# EAGLE design Motor Board (EAGLE 9.5.1)
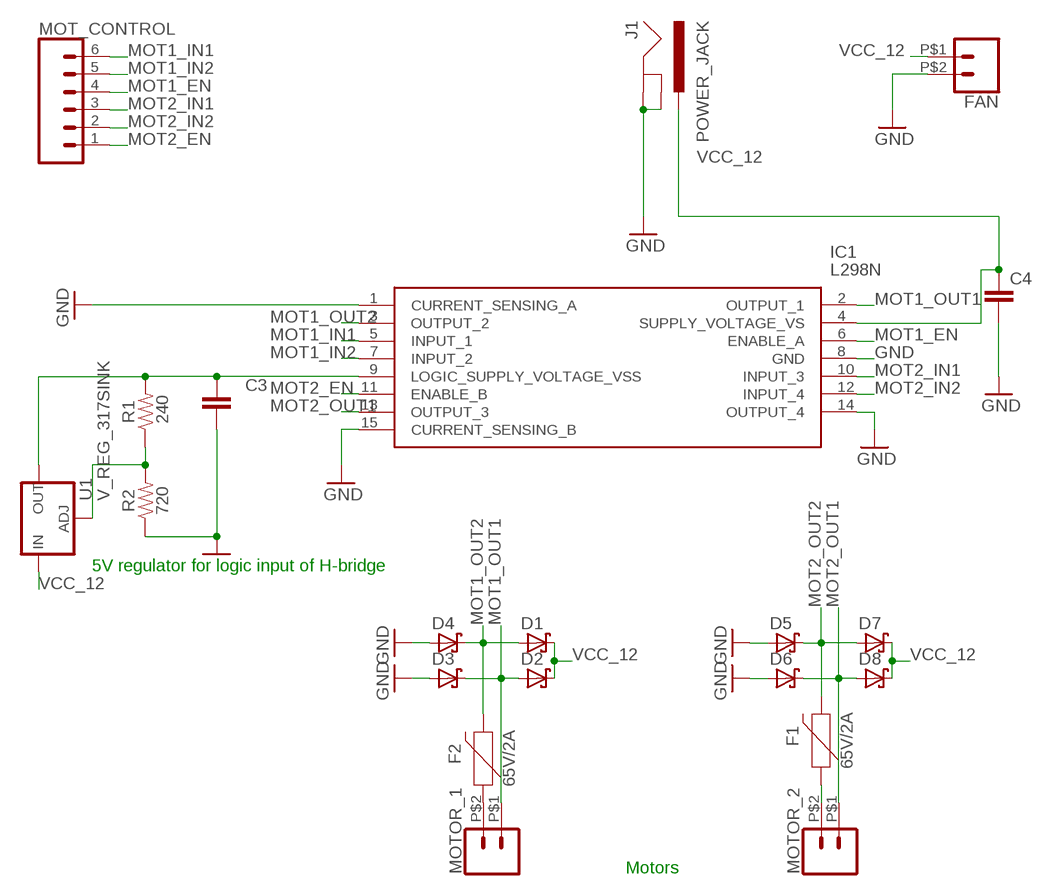
[diagram p0: schematic, sheet 1]

## Parts
C3  C5/5  [C5B5]
C4  C5/5  [C5B5]
D1  SCHOTTKY-DIODEC4111-15  [C4111-15]
D2  SCHOTTKY-DIODEC4111-15  [C4111-15]
D3  SCHOTTKY-DIODEC4111-15  [C4111-15]
D4  SCHOTTKY-DIODEC4111-15  [C4111-15]
D5  SCHOTTKY-DIODEC4111-15  [C4111-15]
D6  SCHOTTKY-DIODEC4111-15  [C4111-15]
D7  SCHOTTKY-DIODEC4111-15  [C4111-15]
D8  SCHOTTKY-DIODEC4111-15  [C4111-15]
F1  65V/2A  PPTC_PTH  [PTH]
F2  65V/2A  PPTC_PTH  [PTH]
FAN  CONN_02PTH2  [1X02_BIG]
IC1  L298N  [MULTIWATT15V_1]
J1  POWER_JACK  [POWER_JACK_PTH]
MOT_CONTROL  CONN_06SILK_FEMALE_PTH  [1X06]
MOTOR_1  CONN_02PTH2  [1X02_BIG]
MOTOR_2  CONN_02PTH2  [1X02_BIG]
R1  240  RESISTORAXIAL-0.3  [AXIAL-0.3]
R2  720  RESISTORAXIAL-0.3  [AXIAL-0.3]
U1  V_REG_317SINK  [TO220-ADJ]

## Nets
GND: C3.2 C4.2 D3.A D4.A D5.A D6.A FAN.P$2 IC1.1(CURRENT_SENSING_A) IC1.8(GND) IC1.14(OUTPUT_4) IC1.15(CURRENT_SENSING_B) J1.GND J1.GNDBREAK R2.P$1
MOT1_EN: IC1.6(ENABLE_A) MOT_CONTROL.4
MOT1_IN1: IC1.5(INPUT_1) MOT_CONTROL.6
MOT1_IN2: IC1.7(INPUT_2) MOT_CONTROL.5
MOT1_OUT1: D2.A D3.C IC1.2(OUTPUT_1) MOTOR_1.P$1
MOT1_OUT2: D1.A D4.C F2.P$2 IC1.3(OUTPUT_2)
MOT2_EN: IC1.11(ENABLE_B) MOT_CONTROL.1
MOT2_IN1: IC1.10(INPUT_3) MOT_CONTROL.3
MOT2_IN2: IC1.12(INPUT_4) MOT_CONTROL.2
MOT2_OUT1: D6.C D8.A IC1.13(OUTPUT_3) MOTOR_2.P$1
MOT2_OUT2: D5.C D7.A F1.P$2
N$1: F2.P$1 MOTOR_1.P$2
N$2: F1.P$1 MOTOR_2.P$2
N$3: C3.1 IC1.9(LOGIC_SUPPLY_VOLTAGE_VSS) R1.P$2 U1.OUT
N$4: R1.P$1 R2.P$2 U1.ADJ
VCC_12: C4.1 D1.C D2.C D7.C D8.C FAN.P$1 IC1.4(SUPPLY_VOLTAGE_VS) J1.PWR U1.IN

## Notes on the sheet
- 5V regulator for logic input of H-bridge
- Motors

## Library data of the parts
C3 C4 = capacitor-wima:C: CAPACITOR naming: grid - package width
D1-D8 = adafruit:SCHOTTKY-DIODE: Schottky Diode
F1 F2 = SparkFun-Fuses:PPTC: Resettable Fuse PPTC Resettable Fuse. Really a sort of resistor with a polymeric positive temperature coefficient whose resistance increases dramatically with an increase in temperature. When heated by the power passing through the resistance rises causing the current to be limited, protecting the circuit. This is achieved by the transition of the polymer from a crystalline to an amorphous state where the conductive carbon separates breaking the conductive pathways found in the cool crystalline structure. When a PPTC cools back down it resumes conducting letting the circuit turn back on. SparkFun Products: SparkFun RedBoard - Programmed with Arduino <https://www.sparkfun.com/products/12757> Pro Micro - 5V/16MHz <https://www.sparkfun.com/products/12640> Arduino Pro 328 - 5V/16MHz <https://www.sparkfun.com/products/10915> MP3 Trigger <https://www.sparkfun.com/products/13720>; PROD_ID: RES-08490; VALUE: 72V/0.25A
FAN MOTOR_1 MOTOR_2 = SparkFun-Connectors:CONN_02: Multi connection point. Often used as Generic Header-pin footprint for 0.1 inch spaced/style header connections On any of the 0.1 inch spaced packages, you can populate with these: Break Away Headers - Straight <https://www.sparkfun.com/products/116> (PRT-00116) Break Away Male Headers - Right Angle <https://www.sparkfun.com/products/553> (PRT-00553) Female Headers <https://www.sparkfun.com/products/115> (PRT-00115) Break Away Headers - Machine Pin <https://www.sparkfun.com/products/117> (PRT-00117) Break Away Female Headers - Swiss Machine Pin <https://www.sparkfun.com/products/743> (PRT-00743) For SCREWTERMINALS and SPRING TERMINALS visit here: Screw Terimnals on SparkFun.com <https://www.sparkfun.com/search/results?term=Screw+Terminals> (5mm/3.5mm/2.54mm spacing) This device is also useful as a general connection point to wire up your design to another part of your project. Our various solder wires solder well into these plated through hole pads. Hook-Up Wire - Assortment (Stranded, 22 AWG) <https://www.sparkfun.com/products/11375> (PRT-11375) Hook-Up Wire - Assortment (Solid Core, 22 AWG) <https://www.sparkfun.com/products/11367> (PRT-11367) View the entire wire category on our website here <https://www.sparkfun.com/categories/141> Special notes: Molex polarized connector foot print use with: PRT-08233 with associated crimp pins and housings. 2.54_SCREWTERM for use with PRT-10571. 3.5mm Screw Terminal footprints for PRT-08084 5mm Screw Terminal footprints for use with PRT-08432
IC1 = SamacSys_Parts:L298N: L298N, Stepper Motor Controller, Dual Full Bridge Motor Driver, 4.8 46 V, 15-Pin MULTIWATT V Source: Datasheet <http://docs-emea.rs-online.com/webdocs/0060/0900766b80060c26.pdf>; DESCRIPTION: L298N, Stepper Motor Controller, Dual Full Bridge Motor Driver, 4.8 46 V, 15-Pin MULTIWATT V; HEIGHT: mm; MANUFACTURER_NAME: Magnatec; MANUFACTURER_PART_NUMBER: L298N; RS_PART_NUMBER: 0636384; RS_PRICE-STOCK: http://uk.rs-online.com/web/p/products/0636384
J1 = SparkFun-Connectors:POWER_JACK: Power Jack Connector This is the standard 5.5mm barrel jack for power. The PTH is the most common, proven, reliable, footprint. The Slot footprint only works if the mill layer is transmitted to the PCB fab house so be warned. Here are the connectors we sell at SparkFun: DC Barrel Power Jack/Connector <https://www.sparkfun.com/products/119> (PRT-00119) DC Barrel Power Jack/Connector (SMD) <https://www.sparkfun.com/products/12748> (PRT-12748) DC Barrel Jack Adapter - Breadboard Compatible <https://www.sparkfun.com/products/10811> (PRT-10811) It is used on this SparkFun product (and many, many others): SparkFun RedBoard - Programmed with Arduino <https://www.sparkfun.com/products/12757> (DEV-12757) Also, if you need a mating power supply or connector, please check these out: Wall Adapter Power Supply - 9VDC 650mA <https://www.sparkfun.com/products/298> (TOL-00298) DC Barrel Jack Adapter - Male <https://www.sparkfun.com/products/10287> (PRT-10287); PROD_ID: CONN-08197
MOT_CONTROL = SparkFun-Connectors:CONN_06: Multi connection point. Often used as Generic Header-pin footprint for 0.1 inch spaced/style header connections On any of the 0.1 inch spaced packages, you can populate with these: Break Away Headers - Straight <https://www.sparkfun.com/products/116> (PRT-00116) Break Away Male Headers - Right Angle <https://www.sparkfun.com/products/553> (PRT-00553) Female Headers <https://www.sparkfun.com/products/115> (PRT-00115) Break Away Headers - Machine Pin <https://www.sparkfun.com/products/117> (PRT-00117) Break Away Female Headers - Swiss Machine Pin <https://www.sparkfun.com/products/743> (PRT-00743) Arduino Stackable Header - 6 Pin <https://www.sparkfun.com/products/9280> (PRT-09280) For SCREWTERMINALS and SPRING TERMINALS visit here: Screw Terimnals on SparkFun.com <https://www.sparkfun.com/search/results?term=Screw+Terminals> (5mm/3.5mm/2.54mm spacing) This device is also useful as a general connection point to wire up your design to another part of your project. Our various solder wires solder well into these plated through hole pads. Hook-Up Wire - Assortment (Stranded, 22 AWG) <https://www.sparkfun.com/products/11375> (PRT-11375) Hook-Up Wire - Assortment (Solid Core, 22 AWG) <https://www.sparkfun.com/products/11367> (PRT-11367) View the entire wire category on our website here <https://www.sparkfun.com/categories/141>; PROD_ID: CONN-08437
R1 R2 = SparkFun-Resistors:RESISTOR: Generic Resistor Package
U1 = SparkFun-IC-Power:V_REG_317: Voltage Regulator Standard LM317 adjustable voltage regulator. AOI (Adjust Output Input). Google 'LM317 Calculator' for easy to use app to get the two resistor values needed. 240/720 for 5V output. 240/390 for 3.3V output. Spark Fun Electronics SKU : COM-00527

## Board
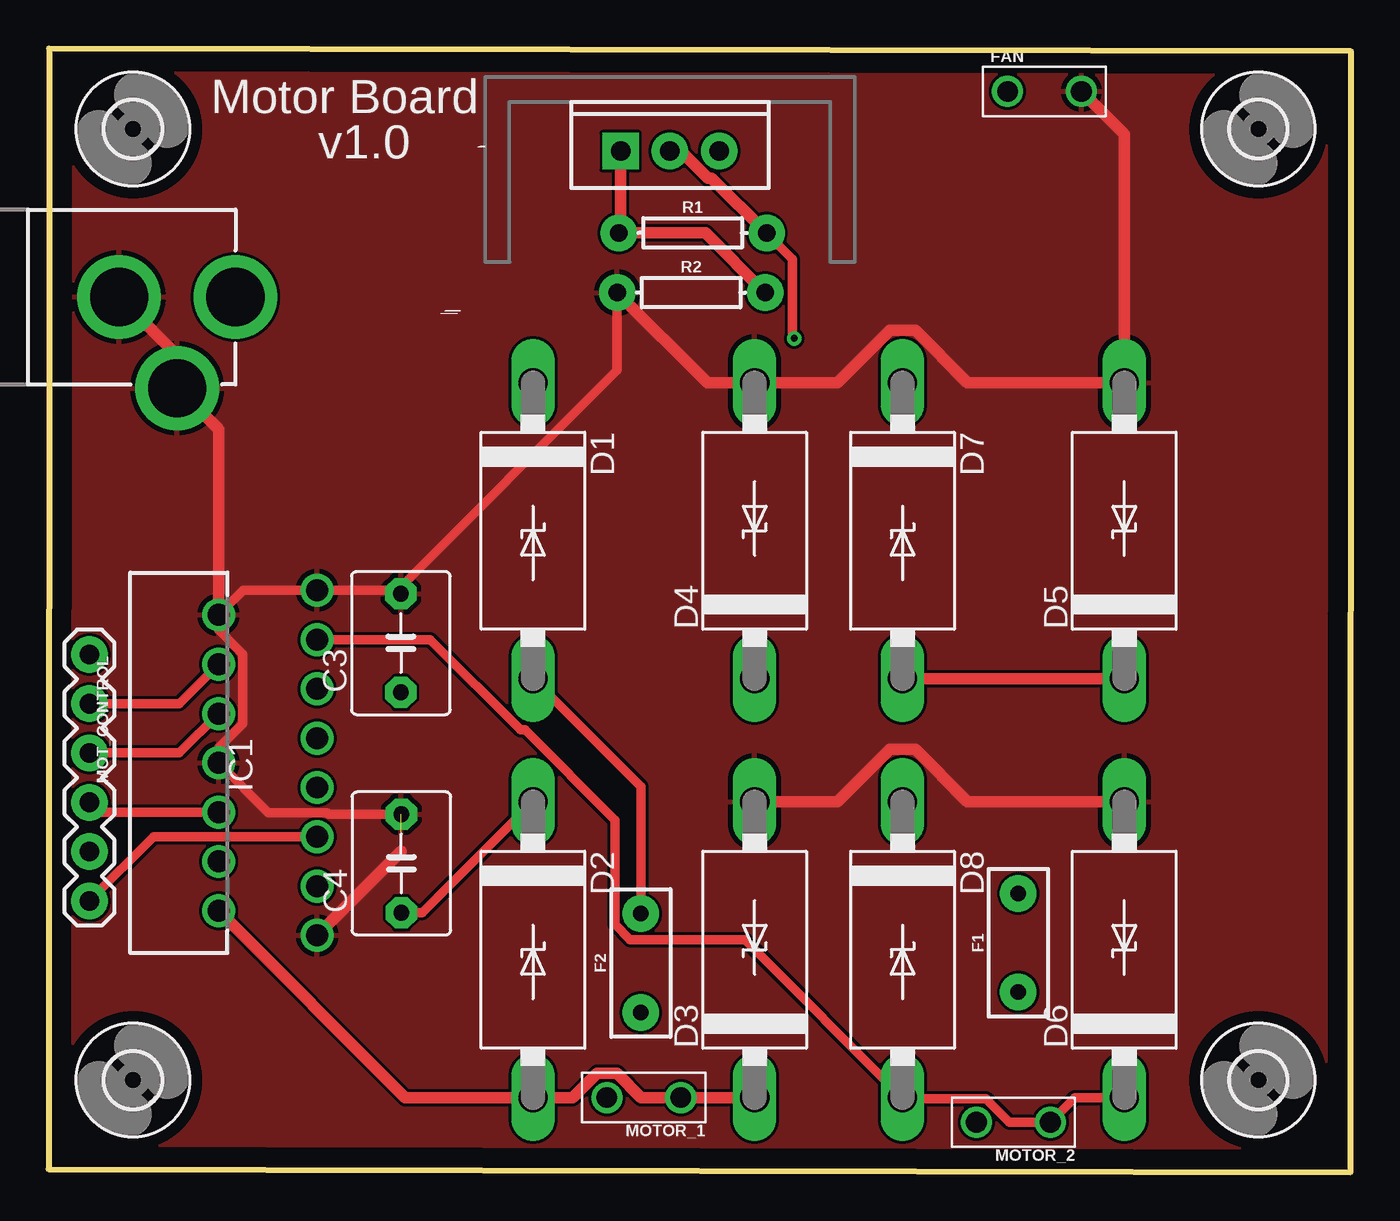
[diagram p1: board, top side]
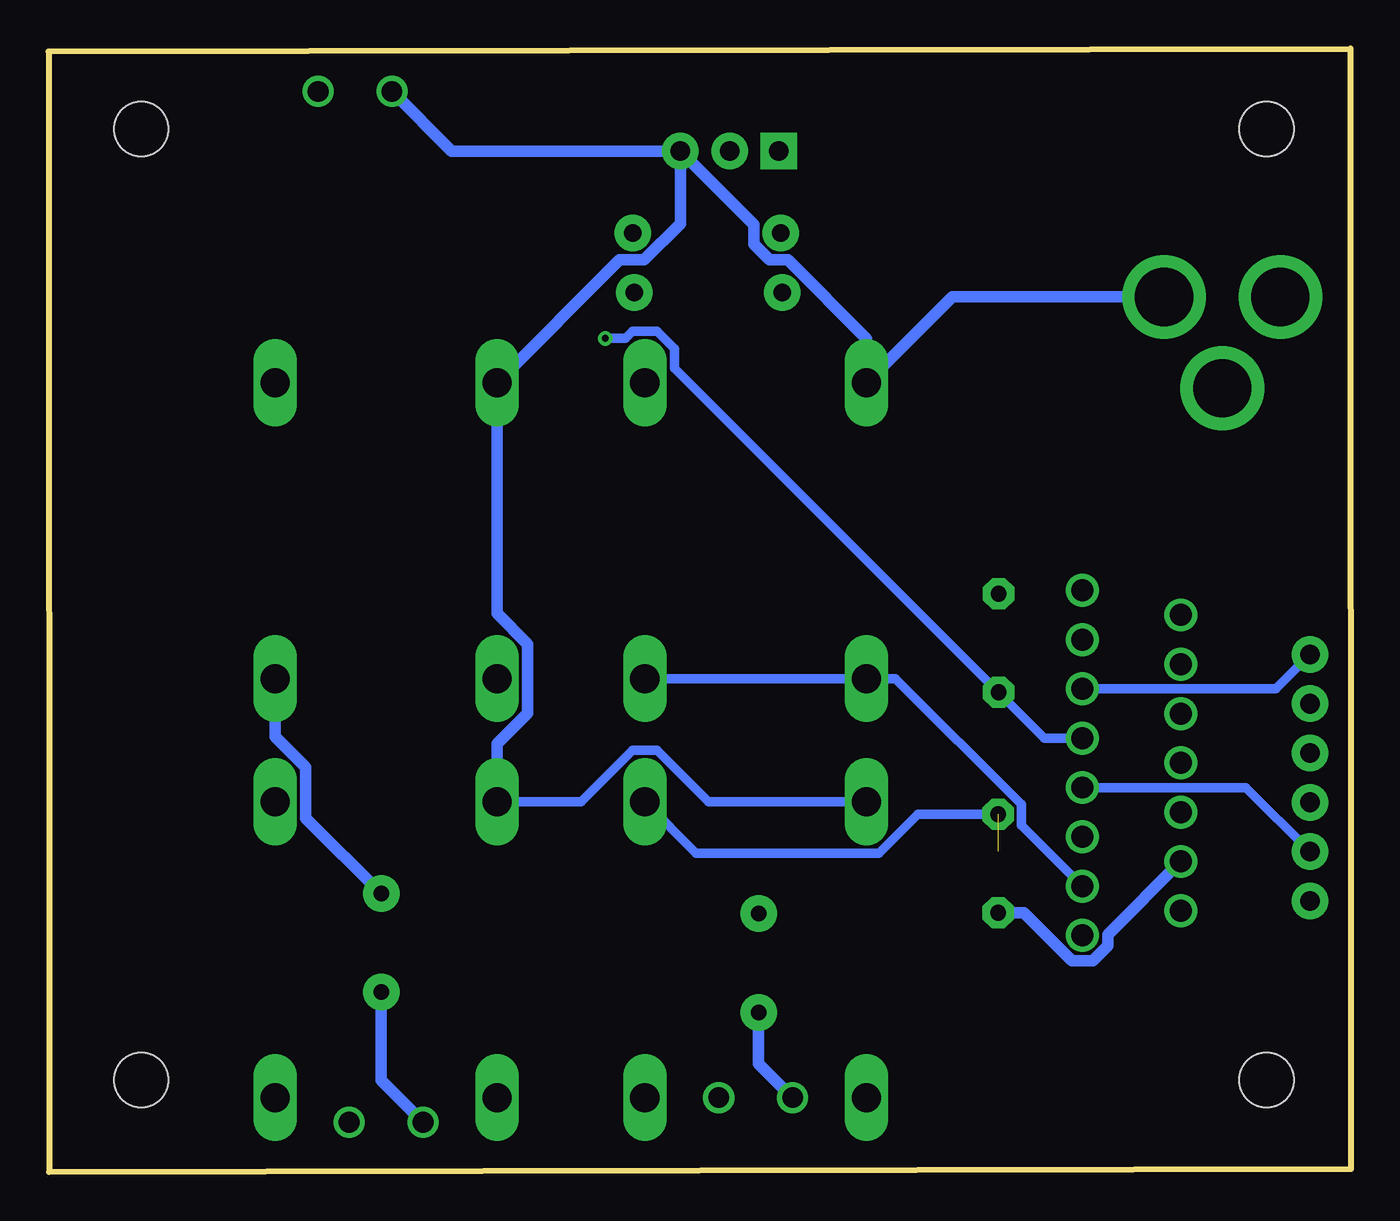
[diagram p2: board, bottom side, seen from below]

Size 67.13 x 57.89 mm. Coordinates in mm from the lower left corner, seen from the top.
Outline: 0,0.15 67.11,0 67.13,57.73 0.03,57.89 0,0.15
Copper layers (1*16): Top 0.035mm / dielectric 1.5mm / Bottom 0.035mm
Design rules "default": minimum track width 6mil, minimum drill 0.35mm, track to track 6mil, track to pad 6mil, pad to pad 6mil, via to via 6mil, smd to smd 6mil, copper to edge 40mil, drill to drill 6mil, minimum pad ring 10mil, minimum via ring 8mil, stop-mask expansion 4mil, vias tented up to drill 0mil, thermal gap 10mil

### Footprints (pad centres in the part's own frame; a part is rotated, then mirrored left to right if it is on the bottom)
C5B5 = drill 0.813 pad 1.6 octagon: 1 -2.54,0; 2 2.54,0
C4111-15 = drill 1.499 long: A 7.62,0; C -7.62,0
PTH = drill 0.8 pad 1.88: P$1 -2.54,0; P$2 2.54,0
1X02_BIG = drill 1.067: P$1 0,0; P$2 3.81,0
MULTIWATT15V_1 = drill 1.13 pad 1.63: 1 -8.89,-5.08; 2 -7.62,0; 3 -6.35,-5.08; 4 -5.08,0; 5 -3.81,-5.08; 6 -2.54,0; 7 -1.27,-5.08; 8 0,0; 9 1.27,-5.08; 10 2.54,0; 11 3.81,-5.08; 12 5.08,0; 13 6.35,-5.08; 14 7.62,0; 15 8.89,-5.08
POWER_JACK_PTH = drill 2.997 pad 4.318: GND 0,7.7; GNDBREAK 4.7,10.7; PWR 0,13.7
1X06 = drill 1.016 pad 1.88: 1 0,0; 2 2.54,0; 3 5.08,0; 4 7.62,0; 5 10.16,0; 6 12.7,0
AXIAL-0.3 = drill 0.9 pad 1.88: P$1 -3.81,0; P$2 3.81,0
TO220-ADJ = drill 1 pad 1.88 square: ADJ -2.54,0 | drill 1 pad 1.88: IN 2.54,0; OUT 0,0
2,8 = hole 2.8: 0,0

### Placement (x,y rotation side)
C3  18.16,27.25 90 top
C4  18.19,15.9 90 top
D1  24.97,33.05 270 top
D2  24.97,11.46 270 top
D3  36.4,11.46 90 top
D4  36.4,33.05 90 top
D5  55.45,33.05 90 top
D6  55.45,11.46 90 top
D7  44.02,33.05 270 top
D8  44.02,11.46 270 top
F1  49.99,11.81 90 top
F2  30.53,10.77 90 top
FAN  49.43,55.68 0 top
IC1  8.76,21.08 90 top
J1  -4.06,45.09 270 top
MOT_CONTROL  2.11,26.67 270 top
MOTOR_1  32.59,3.84 180 top
MOTOR_2  51.64,2.57 180 top
R1  33.2,48.39 0 top
R2  33.12,45.31 0 top
U1  32.03,52.6 0 top
U$2  [2,8]  4.36,53.74 0 top
U$3  [2,8]  62.36,4.74 0 top
U$4  [2,8]  4.36,4.74 180 top
U$5  [2,8]  62.36,53.74 0 top

### Tracks (layer width: path | path; a pad name or v marks a point on that pad's centre or on a via)
GND  (1 unrouted)
  Top 0.5: C4.2 14.44,18.44 14.36,18.52 11.32,18.52 IC1.8 8.76,21.85 10.01,23.1 10.01,26.68 8.76,27.93 IC1.14 10.03,29.97 IC1.15 17.98,29.97 | 17.98,29.97 C3.2 | R2.P$1 29.31,41.3 17.98,29.97
  Top 0.6: FAN.P$2 55.45,53.47 D5.A 47.37,40.67 44.67,43.37 43.37,43.37 40.66,40.67 D4.A 33.96,40.67 R2.P$1 | J1.GND 6.64,42.09 J1.GNDBREAK 8.76,38.26 IC1.14 | IC1.1 18.19,16.54 | D3.A 40.66,19.08 43.37,21.78 44.67,21.78 47.37,19.08 D6.A
  Bottom 0.5: C4.2 22.32,18.44 24.34,16.43 33.75,16.43 D3.A
  pour Top: 0,0.23 67.16,0.23 67.16,57.76 -0.03,57.76 -0.03,0.41 0,0.38
MOT1_EN
  Top 0.5: IC1.6 2.62,18.54 MOT_CONTROL.4
MOT1_IN1
  Top 0.5: IC1.5 5.41,17.27 MOT_CONTROL.6
MOT1_IN2
  Bottom 0.5: MOT_CONTROL.5 5.41,19.81 IC1.7
MOT1_OUT1
  Top 0.6: D3.C MOTOR_1.P$1 30.55,3.84 29.3,5.09 28.26,5.09 27.01,3.84 D2.A 18.39,3.84 IC1.2
MOT1_OUT2
  Top 0.5: D1.A 30.53,19.86 F2.P$2
  Bottom 0.5: IC1.3 16.98,17.87 16.98,18.94 23.47,25.43 D1.A D4.C
MOT2_EN
  Bottom 0.5: MOT_CONTROL.1 3.89,24.89 IC1.11
MOT2_IN1
  Top 0.5: IC1.10 6.73,21.59 MOT_CONTROL.3
MOT2_IN2
  Top 0.5: IC1.12 6.73,24.13 MOT_CONTROL.2
MOT2_OUT1
  Top 0.5: D6.C 52.91,3.84 MOTOR_2.P$1 49.53,2.57 48.33,3.77 44.09,3.77 D8.A 35.89,11.97 29.98,11.97 29.19,12.75 29.19,18.14 24.55,22.78 24.34,22.78 19.68,27.43 IC1.13
MOT2_OUT2
  Top 0.6: D7.A D5.C
  Bottom 0.6: F1.P$2 53.87,18.24 53.87,20.85 55.45,22.43 D5.C
N$1
  Bottom 0.6: MOTOR_1.P$2 30.53,5.59 F2.P$1
N$2
  Bottom 0.6: MOTOR_2.P$2 49.99,4.72 F1.P$1
N$3  (via drill 0.35)
  Top 0.5: R1.P$2 38.35,47.04 38.35,42.95 v38.43,42.95
  Top 0.6: R1.P$2 34.18,51.21 33.99,51.21 32.6,52.6 U1.OUT
  Bottom 0.5: v38.43,42.95 37.4,42.95 37.03,43.32 35.77,43.32 34.87,42.42 34.87,41.43 C3.1 15.8,22.35 IC1.9
N$4
  Top 0.6: U1.ADJ 29.49,48.49 R1.P$1 33.86,48.39 R2.P$2
VCC_12
  Top 0.5: D2.C 19.25,13.36 C4.1
  Bottom 0.5: D2.C 33.12,19.08 35.77,21.73 37.03,21.73 39.68,19.08 D8.C
  Bottom 0.6: U1.IN 34.57,48.86 36.43,46.99 37.69,46.99 D7.C 44.02,28.78 42.44,27.2 42.44,23.65 44.02,22.07 D8.C | U1.IN 46.35,52.6 FAN.P$1 | J1.PWR 20.55,45.09 D1.C 24.97,42.94 29.02,46.99 29.96,46.99 30.78,47.81 30.78,48.81 U1.IN | C4.1 16.85,13.36 14.38,10.89 13.3,10.89 12.54,11.65 12.54,12.22 IC1.4

### Text on the board
tPlace: Motor Board | v1.0